# EasyEDA schematic 8086_ELEVATOR_PROJECT.json
TITLE: Sheet_1; REV: 1.0; Date: 2019-12-03; Sheet: 1/1; Company: Your Company
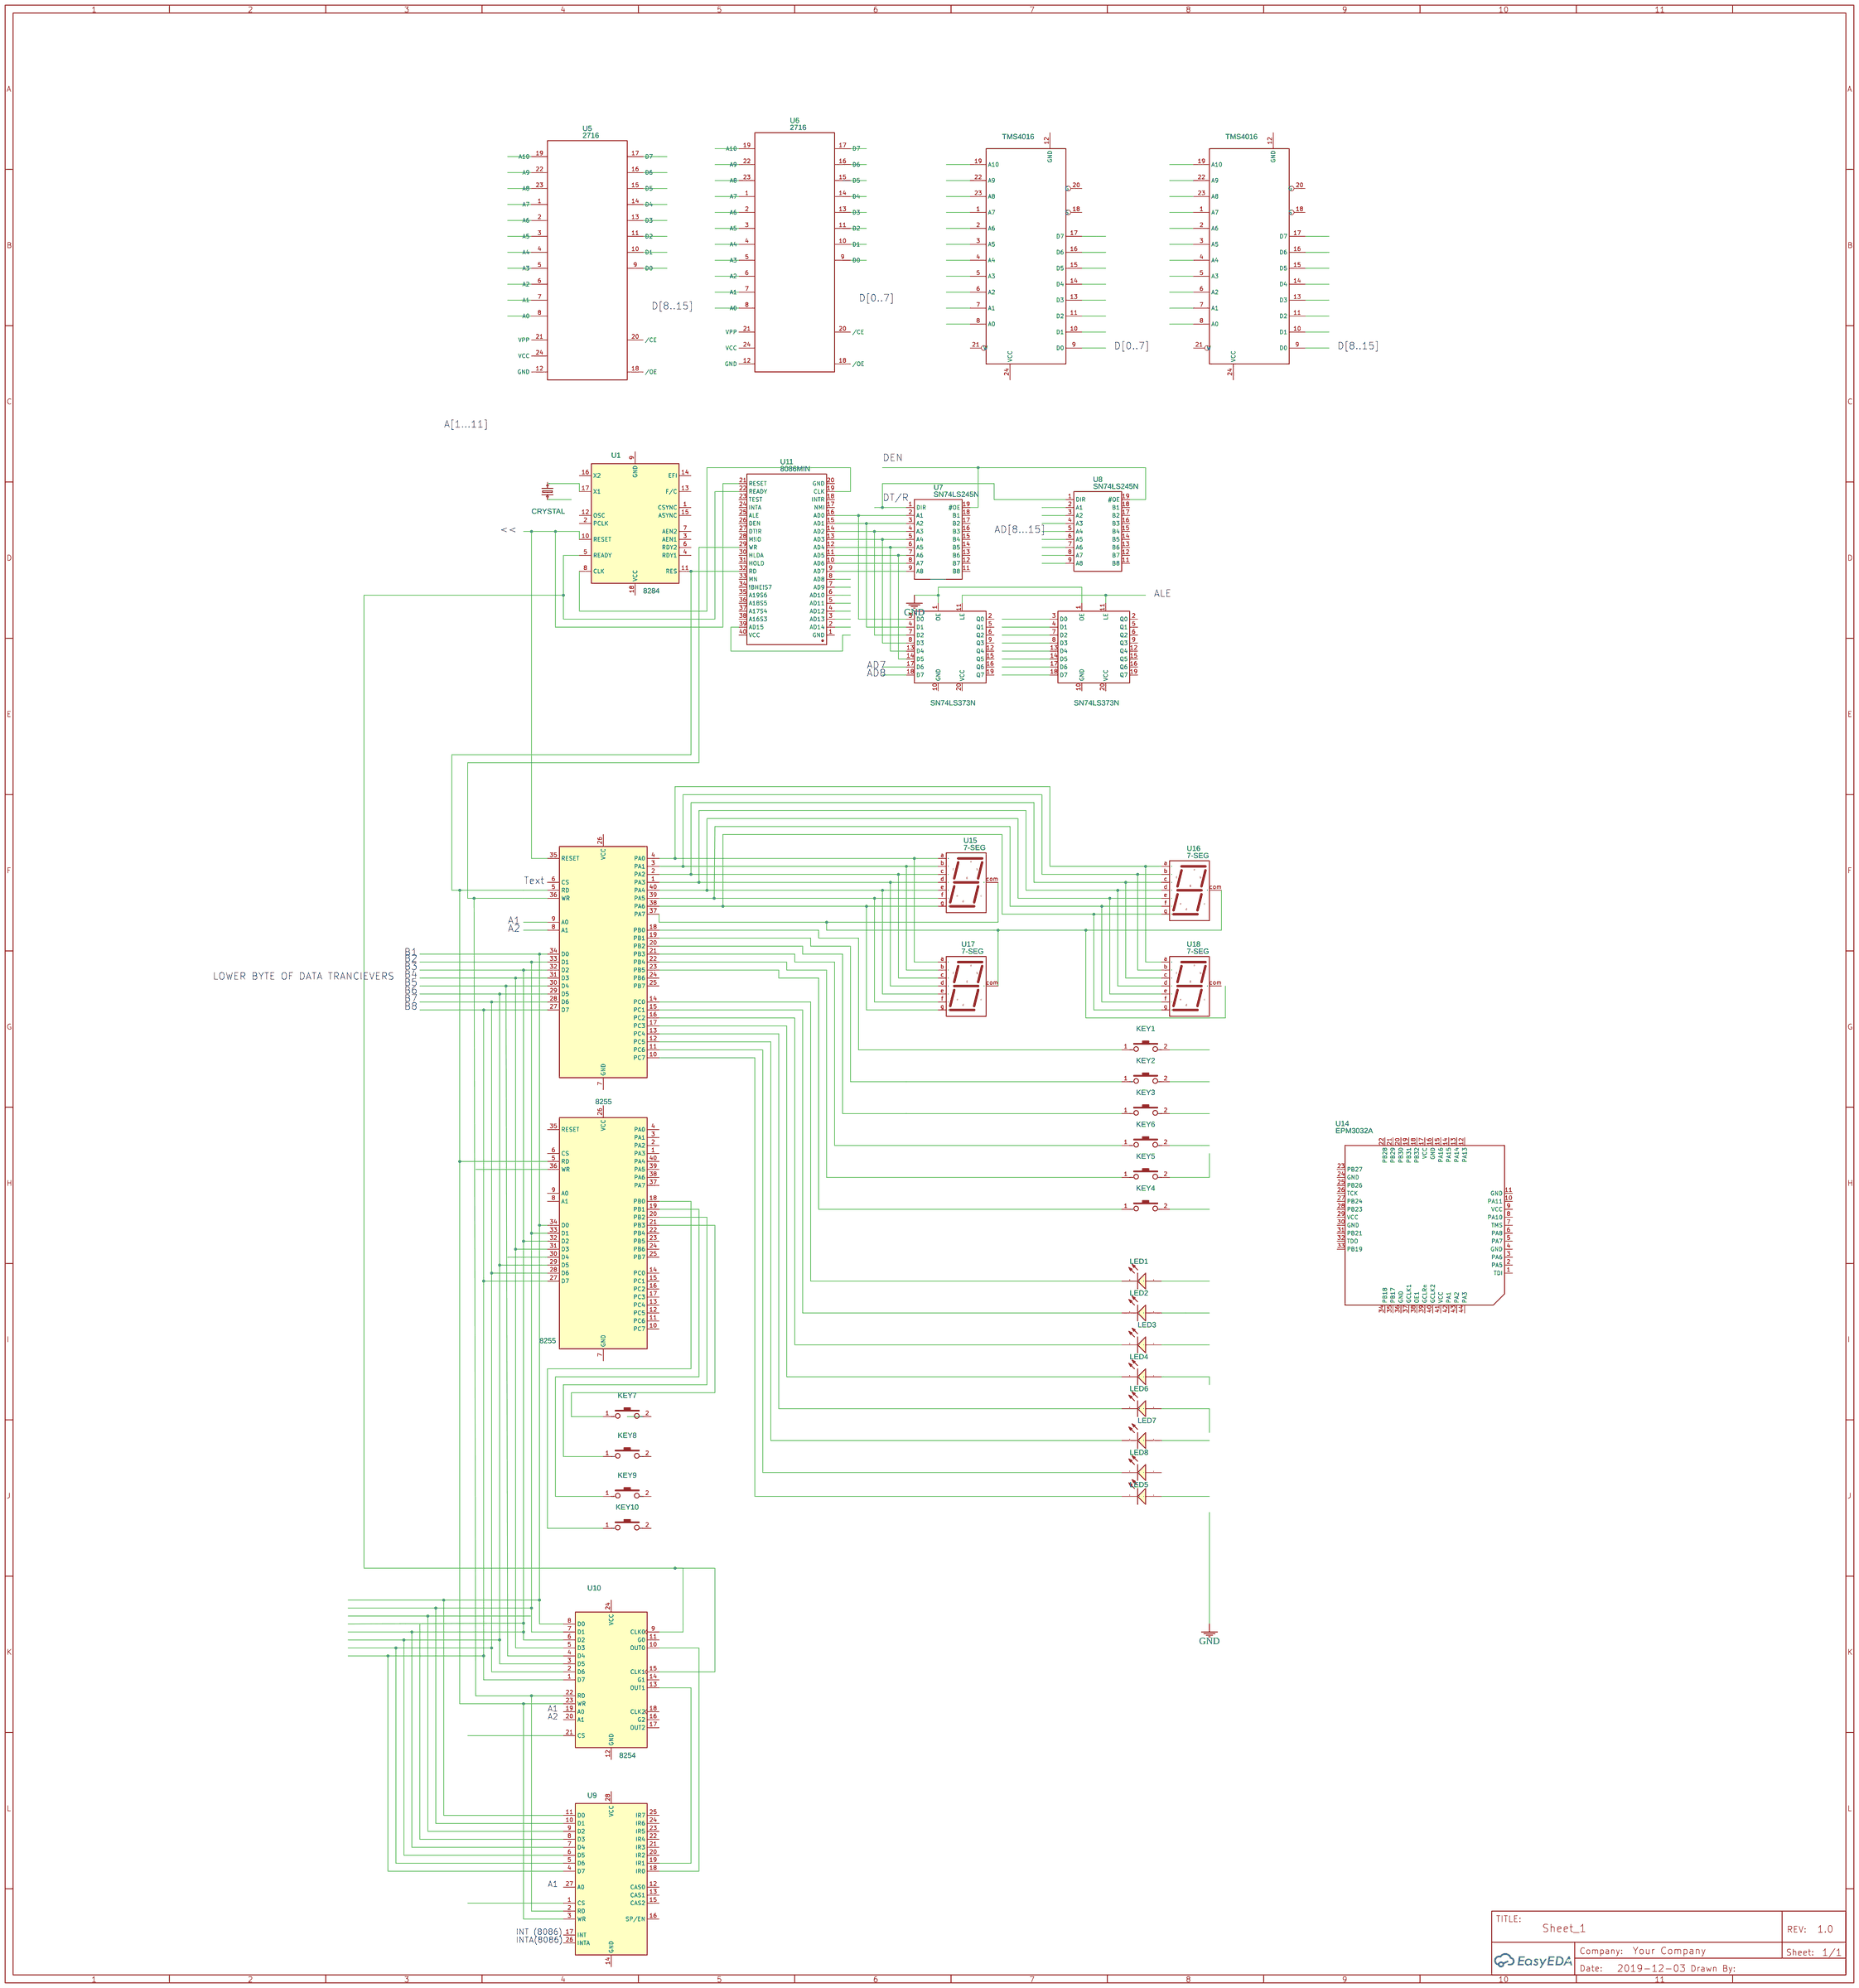
[diagram p0: schematic sheet]

## Parts
KEY1  6*6*5 Silicone silent key button  [KEY-SMD_2P-L6.0-W6.0-P6.00]
KEY2  6*6*5 Silicone silent key button  [KEY-SMD_2P-L6.0-W6.0-P6.00]
KEY3  6*6*5 Silicone silent key button  [KEY-SMD_2P-L6.0-W6.0-P6.00]
KEY4  6*6*5 Silicone silent key button  [KEY-SMD_2P-L6.0-W6.0-P6.00]
KEY5  6*6*5 Silicone silent key button  [KEY-SMD_2P-L6.0-W6.0-P6.00]
KEY6  6*6*5 Silicone silent key button  [KEY-SMD_2P-L6.0-W6.0-P6.00]
KEY7  6*6*5 Silicone silent key button  [KEY-SMD_2P-L6.0-W6.0-P6.00]
KEY8  6*6*5 Silicone silent key button  [KEY-SMD_2P-L6.0-W6.0-P6.00]
KEY9  6*6*5 Silicone silent key button  [KEY-SMD_2P-L6.0-W6.0-P6.00]
KEY10  6*6*5 Silicone silent key button  [KEY-SMD_2P-L6.0-W6.0-P6.00]
LED1  LEDBlue light  [LED-SMD_L3.6-W2.9-R-RD]
LED2  LEDBlue light  [LED-SMD_L3.6-W2.9-R-RD]
LED3  LEDBlue light  [LED-SMD_L3.6-W2.9-R-RD]
LED4  LEDBlue light  [LED-SMD_L3.6-W2.9-R-RD]
LED5  LEDBlue light  [LED-SMD_L3.6-W2.9-R-RD]
LED6  LEDBlue light  [LED-SMD_L3.6-W2.9-R-RD]
LED7  LEDBlue light  [LED-SMD_L3.6-W2.9-R-RD]
LED8  LEDBlue light  [LED-SMD_L3.6-W2.9-R-RD]
Q1  CRYSTAL  [HC49TL-H]
U1  8284  [DIP-18_W7.62MM]
U2  TMS4016
U3  TMS4016
U4  8255  [DIP-40_W15.24MM]
U5  2716  [DIP24-600]
U6  2716  [DIP24-600]
U7  SN74LS245N  [DIP-20_300MIL]
U8  SN74LS245N  [DIP-20_300MIL]
U9  8259  [DIP-28_W15.24MM]
U10  8254  [DIP-24_W15.24MM]
U11  8086MIN  [DIP40]
U12  SN74LS373N  [DIP-20]
U13  SN74LS373N  [DIP-20]
U14  EPM3032A  [TQFP44-0.8-9.6X9.6MM]
U15  7-SEG  [7-SEG-]
U16  7-SEG  [7-SEG-]
U17  7-SEG  [7-SEG-]
U18  7-SEG  [7-SEG-]
U19  8255  [DIP-40_W15.24MM]

## Library data of the parts
KEY1-KEY10 = -: Supplier Part: C61120; Supplier: LCSC; Manufacturer: ReliaPro
LED1-LED8 = -: Supplier Part: C69273; Supplier: LCSC; Manufacturer: ReliaPro; image: http://image.lceda.cn/szlcsc/C69273.jpg; LCSC Assembly: Yes; SMT Type: Extend
U1 U4 U19 = -: Contributor: KiCAD; license: https://www.gnu.org/licenses/lgpl-2.1.html
U2 U3 = -: Contributor: cosine
U5 U6 = -: Manufacturer Part: 27C16; Contributor: Thirtykay
U7 U8 = -: Supplier: LCSC; Supplier Part: C352966; Manufacturer: Texas Instruments; Contributor: simonj5
U9 U10 = -: Contributor: jfcroft245
U12 U13 = -: Supplier Part: C10423; Supplier: LCSC; Manufacturer: TI
U14 = -: Altera FPGA MAX3000A; sourceId: bLFzQ8qI0
U15-U18 = -: Contributor: KiCad

## Nets
GND: U12.1(OE) U13.1(OE)
Net-(KEY1-1): KEY1.1 U4.18(PB0)
Net-(KEY2-1): KEY2.1 U4.19(PB1)
Net-(KEY3-1): KEY3.1 U4.20(PB2)
Net-(KEY4-1): KEY4.1 U4.23(PB5)
Net-(KEY5-1): KEY5.1 U4.22(PB4)
Net-(KEY6-1): KEY6.1 U4.21(PB3)
Net-(KEY7-1): KEY7.1 U19.21(PB3)
Net-(KEY8-1): KEY8.1 U19.20(PB2)
Net-(KEY9-1): KEY9.1 U19.19(PB1)
Net-(KEY10-1): KEY10.1 U19.18(PB0)
Net-(LED1-2): LED1.2 U4.14(PC0)
Net-(LED2-2): LED2.2 U4.15(PC1)
Net-(LED3-2): LED3.2 U4.16(PC2)
Net-(LED4-2): LED4.2 U4.17(PC3)
Net-(LED5-2): LED5.2 U4.10(PC7)
Net-(LED6-2): LED6.2 U4.13(PC4)
Net-(LED7-2): LED7.2 U4.12(PC5)
Net-(LED8-2): LED8.2 U4.11(PC6)
Net-(Q1-1): Q1.1 U1.17(X1)
Net-(U1-5): U1.5(READY) U10.9(CLK0) U10.15(CLK1) U11.22(READY)
Net-(U1-8): U1.8(CLK) U11.19(CLK)
Net-(U1-10): U1.10(RESET) U4.35(RESET) U11.21(RESET)
Net-(U1-11): U1.11(RES) U4.5(RD) U9.3(WR) U10.23(WR) U11.32(RD) U19.5(RD)
Net-(U4-1): U4.1(PA3) U15.d U16.d U17.d U18.d
Net-(U4-2): U4.2(PA2) U15.c U16.c U17.c U18.c
Net-(U4-3): U4.3(PA1) U15.b U16.b U17.b U18.b
Net-(U4-4): U4.4(PA0) U15.a U16.a U17.a U18.a
Net-(U4-27): U4.27(D7) U9.4(D7) U10.1(D7) U19.27(D7)
Net-(U4-28): U4.28(D6) U9.5(D6) U10.2(D6) U19.28(D6)
Net-(U4-29): U4.29(D5) U9.6(D5) U10.3(D5) U19.29(D5)
Net-(U4-30): U4.30(D4) U10.4(D4)
Net-(U4-31): U4.31(D3) U10.5(D3) U19.31(D3)
Net-(U4-32): U4.32(D2) U9.7(D4) U10.6(D2) U19.32(D2)
Net-(U4-33): U4.33(D1) U9.10(D1) U10.7(D1) U19.33(D1)
Net-(U4-34): U4.34(D0) U9.11(D0) U10.8(D0) U19.34(D0)
Net-(U4-36): U4.36(WR) U9.2(RD) U10.22(RD) U11.29(WR)
Net-(U4-37): U4.37(PA7) U15.com U16.com U17.com
Net-(U4-38): U4.38(PA6) U15.g U16.g U17.g U18.g
Net-(U4-39): U4.39(PA5) U15.f U16.f U17.f U18.f
Net-(U4-40): U4.40(PA4) U15.e U16.e U17.e U18.e
Net-(U7-1): U7.1(DIR) U8.1(DIR)
Net-(U7-2): U7.2(A1) U11.16(AD0) U13.3(D0)
Net-(U7-3): U7.3(A2) U11.15(AD1) U13.4(D1)
Net-(U7-4): U7.4(A3) U11.14(AD2) U13.7(D2)
Net-(U7-5): U7.5(A4) U11.13(AD3) U13.8(D3)
Net-(U7-6): U7.6(A5) U11.12(AD4) U13.13(D4)
Net-(U7-7): U7.7(A6) U11.11(AD5) U13.14(D5)
Net-(U7-8): U7.8(A7) U11.10(AD6)
Net-(U7-9): U7.9(A8) U11.9(AD7)
Net-(U7-19): U7.19(#OE) U8.19(#OE)
Net-(U9-18): U9.18(IR0) U10.10(OUT0)
Net-(U9-19): U9.19(IR1) U10.13(OUT1)
Net-(U12-11): U12.11(LE) U13.11(LE)

Not connected (* = marked no-connect by the designer): KEY1 2; KEY2 2; KEY3 2; KEY4 2; KEY5 2; KEY6 2; KEY7 2; KEY8 2; KEY9 2; KEY10 2; LED1 1; LED2 1; LED3 1; LED4 1; LED5 1; LED6 1; LED7 1; LED8 1; Q1 2; U1 1(CSYNC) 2(PCLK) 3(AEN1) 4(RDY1) 6(RDY2) 7(AEN2) 9(GND) 12(OSC) 13(F/C) 14(EFI) 15(ASYNC) 16(X2) 18(VCC); U2 1(A7) 2(A6) 3(A5) 4(A4) 5(A3) 6(A2) 7(A1) 8(A0) 9(D0) 10(D1) 11(D2) 12(GND) 13(D3) 14(D4) 15(D5) 16(D6) 17(D7) 18(S) 19(A10) 20(G) 21(W) 22(A9) 23(A8) 24(VCC); U3 1(A7) 2(A6) 3(A5) 4(A4) 5(A3) 6(A2) 7(A1) 8(A0) 9(D0) 10(D1) 11(D2) 12(GND) 13(D3) 14(D4) 15(D5) 16(D6) 17(D7) 18(S) 19(A10) 20(G) 21(W) 22(A9) 23(A8) 24(VCC); U4 6(CS) 7(GND) 8(A1) 9(A0) 24(PB6) 25(PB7) 26(VCC); U5 1(A7) 2(A6) 3(A5) 4(A4) 5(A3) 6(A2) 7(A1) 8(A0) 9(D0) 10(D1) 11(D2) 12(GND) 13(D3) 14(D4) 15(D5) 16(D6) 17(D7) 18(/OE) 19(A10) 20(/CE) 21(VPP) 22(A9) 23(A8) 24(VCC); U6 1(A7) 2(A6) 3(A5) 4(A4) 5(A3) 6(A2) 7(A1) 8(A0) 9(D0) 10(D1) 11(D2) 12(GND) 13(D3) 14(D4) 15(D5) 16(D6) 17(D7) 18(/OE) 19(A10) 20(/CE) 21(VPP) 22(A9) 23(A8) 24(VCC); U7 11(B8) 12(B7) 13(B6) 14(B5) 15(B4) 16(B3) 17(B2) 18(B1); U8 2(A1) 3(A2) 4(A3) 5(A4) 6(A5) 7(A6) 8(A7) 9(A8) 11(B8) 12(B7) 13(B6) 14(B5) 15(B4) 16(B3) 17(B2) 18(B1); U9 1(CS) 8(D3) 9(D2) 12(CAS0) 13(CAS1) 14(GND) 15(CAS2) 16(SP/EN) 17(INT) 20(IR2) 21(IR3) 22(IR4) 23(IR5) 24(IR6) 25(IR7) 26(INTA) 27(A0) 28(VCC); U10 11(G0) 12(GND) 14(G1) 16(G2) 17(OUT2) 18(CLK2) 19(A0) 20(A1) 21(CS) 24(VCC); U11 1(GND) 2(AD14) 3(AD13) 4(AD12) 5(AD11) 6(AD10) 7(AD9) 8(AD8) 17(NMI) 18(INTR) 20(GND) 23(TEST) 24(INTA) 25(ALE) 26(DEN) 27(DT!R) 28(M!IO) 30(HLDA) 31(HOLD) 33(MN) 34(!BHE!S7) 35(A19S6) 36(A18S5) 37(A17S4) 38(A16S3) 39(AD15) 40(VCC); U12 2(Q0) 3(D0) 4(D1) 5(Q1) 6(Q2) 7(D2) 8(D3) 9(Q3) 10(GND) 12(Q4) 13(D4) 14(D5) 15(Q5) 16(Q6) 17(D6) 18(D7) 19(Q7) 20(VCC); U13 2(Q0) 5(Q1) 6(Q2) 9(Q3) 10(GND) 12(Q4) 15(Q5) 16(Q6) 17(D6) 18(D7) 19(Q7) 20(VCC); U14 1(TDI) 2(PA5) 3(PA6) 4(GND) 5(PA7) 6(PA8) 7(TMS) 8(PA10) 9(VCC) 10(PA11) 11(GND) 12(PA13) 13(PA14) 14(PA15) 15(PA16) 16(GND) 17(VCC) 18(PB32) 19(PB31) 20(PB30) 21(PB29) 22(PB28) 23(PB27) 24(GND) 25(PB26) 26(TCK) 27(PB24) 28(PB23) 29(VCC) 30(GND) 31(PB21) 32(TDO) 33(PB19) 34(PB18) 35(PB17) 36(GND) 37(GCLK1) 38(OE1) 39(GCLRn) 40(GCLK2) 41(VCC) 42(PA1) 43(PA2) 44(PA3); U18 com; U19 1(PA3) 2(PA2) 3(PA1) 4(PA0) 6(CS) 7(GND) 8(A1) 9(A0) 10(PC7) 11(PC6) 12(PC5) 13(PC4) 14(PC0) 15(PC1) 16(PC2) 17(PC3) 22(PB4) 23(PB5) 24(PB6) 25(PB7) 26(VCC) 30(D4) 35(RESET) 36(WR) 37(PA7) 38(PA6) 39(PA5) 40(PA4)

## Notes on the sheet
- D[0..7]
- D[8..15]
- D[0..7]
- D[8..15]
- A[1...11]
- DEN
- DT/R
- <<
- AD[8...15]
- ALE
- AD7
- AD8
- Text
- A1
- A2
- B1
- B2
- B3
- LOWER BYTE OF DATA TRANCIEVERS
- B4
- B5
- B6
- B7
- B8
- A1
- A2
- A1
- INT (8086)
- INTA(8086)
